# Altium schematic sheet EEG_3.SchDoc
size A3
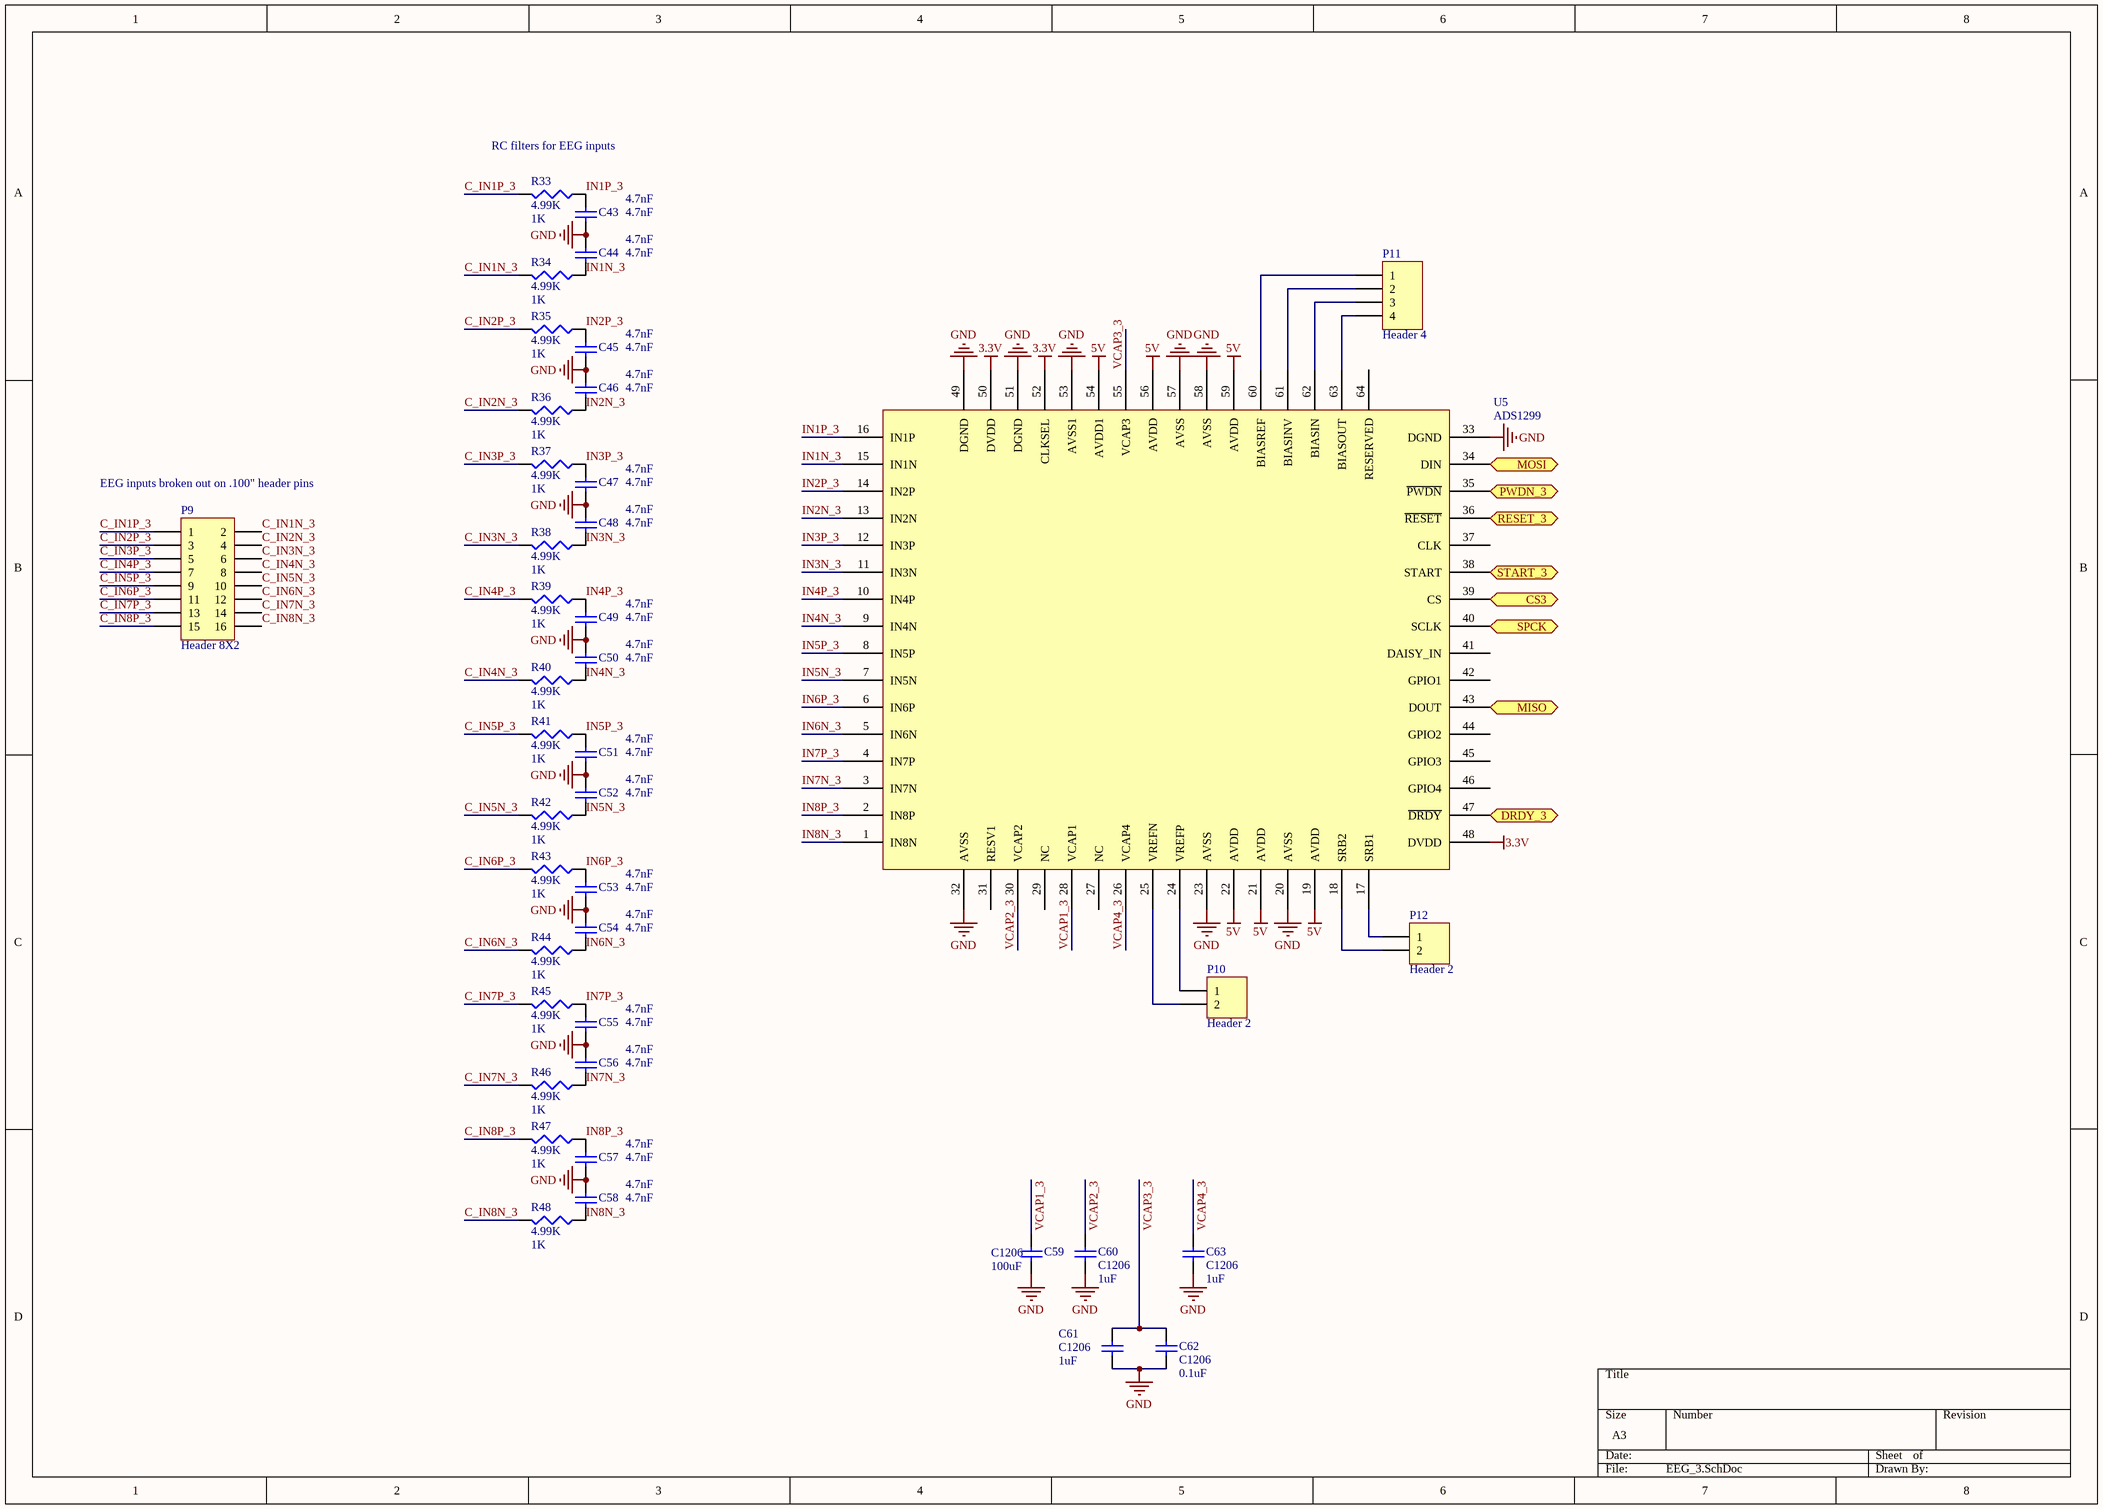
[diagram p0: EEG_3.SchDoc]

## Parts
C43  4.7nF  [1608[0603]]
C44  4.7nF  [1608[0603]]
C45  4.7nF  [1608[0603]]
C46  4.7nF  [1608[0603]]
C47  4.7nF  [1608[0603]]
C48  4.7nF  [1608[0603]]
C49  4.7nF  [1608[0603]]
C50  4.7nF  [1608[0603]]
C51  4.7nF  [1608[0603]]
C52  4.7nF  [1608[0603]]
C53  4.7nF  [1608[0603]]
C54  4.7nF  [1608[0603]]
C55  4.7nF  [1608[0603]]
C56  4.7nF  [1608[0603]]
C57  4.7nF  [1608[0603]]
C58  4.7nF  [1608[0603]]
C59  C1206  value 100uF  [1608[0603]]
C60  C1206  value 1uF  [1608[0603]]
C61  C1206  value 1uF  [1608[0603]]
C62  C1206  value 0.1uF  [1608[0603]]
C63  C1206  value 1uF  [1608[0603]]
P9  Header 8X2  [HDR2X8]
P10  Header 2  [HDR1X2]
P11  Header 4  [HDR1X4]
P12  Header 2  [HDR1X2]
R33  4.99K  value 1K  [1608[0603]]
R34  4.99K  value 1K  [1608[0603]]
R35  4.99K  value 1K  [1608[0603]]
R36  4.99K  value 1K  [1608[0603]]
R37  4.99K  value 1K  [1608[0603]]
R38  4.99K  value 1K  [1608[0603]]
R39  4.99K  value 1K  [1608[0603]]
R40  4.99K  value 1K  [1608[0603]]
R41  4.99K  value 1K  [1608[0603]]
R42  4.99K  value 1K  [1608[0603]]
R43  4.99K  value 1K  [1608[0603]]
R44  4.99K  value 1K  [1608[0603]]
R45  4.99K  value 1K  [1608[0603]]
R46  4.99K  value 1K  [1608[0603]]
R47  4.99K  value 1K  [1608[0603]]
R48  4.99K  value 1K  [1608[0603]]
U5  ADS1299  [ADS1299 Plastic QFP]

## Ports
CS3, DRDY_3, MISO, MOSI, PWDN_3, RESET_3, SPCK, START_3

## Nets
3.3V: U5.48(DVDD) U5.50(DVDD) U5.52(CLKSEL)
5V: U5.19(AVDD) U5.21(AVDD) U5.22(AVDD) U5.54(AVDD1) U5.56(AVDD) U5.59(AVDD)
GND: C43.1 C44.2 C45.1 C46.2 C47.1 C48.2 C49.1 C50.2 C51.1 C52.2 C53.1 C54.2 C55.1 C56.2 C57.1 C58.2 C59.2 C60.1 C61.2 C62.1 C63.1 U5.20(AVSS) U5.23(AVSS) U5.32(AVSS) U5.33(DGND) U5.49(DGND) U5.51(DGND) U5.53(AVSS1) U5.57(AVSS) U5.58(AVSS)
C_IN1N_3: P9.2 R34.2
C_IN1P_3: P9.1 R33.2
C_IN2N_3: P9.4 R36.2
C_IN2P_3: P9.3 R35.2
C_IN3N_3: P9.6 R38.2
C_IN3P_3: P9.5 R37.2
C_IN4N_3: P9.8 R40.2
C_IN4P_3: P9.7 R39.2
C_IN5N_3: P9.10 R42.2
C_IN5P_3: P9.9 R41.2
C_IN6N_3: P9.12 R44.2
C_IN6P_3: P9.11 R43.2
C_IN7N_3: P9.14 R46.2
C_IN7P_3: P9.13 R45.2
C_IN8N_3: P9.16 R48.2
C_IN8P_3: P9.15 R47.2
CS3: U5.39(CS) ; port CS3
DRDY_3: U5.47(~{DRDY}) ; port DRDY_3
IN1N_3: C44.1 R34.1 U5.15(IN1N)
IN1P_3: C43.2 R33.1 U5.16(IN1P)
IN2N_3: C46.1 R36.1 U5.13(IN2N)
IN2P_3: C45.2 R35.1 U5.14(IN2P)
IN3N_3: C48.1 R38.1 U5.11(IN3N)
IN3P_3: C47.2 R37.1 U5.12(IN3P)
IN4N_3: C50.1 R40.1 U5.9(IN4N)
IN4P_3: C49.2 R39.1 U5.10(IN4P)
IN5N_3: C52.1 R42.1 U5.7(IN5N)
IN5P_3: C51.2 R41.1 U5.8(IN5P)
IN6N_3: C54.1 R44.1 U5.5(IN6N)
IN6P_3: C53.2 R43.1 U5.6(IN6P)
IN7N_3: C56.1 R46.1 U5.3(IN7N)
IN7P_3: C55.2 R45.1 U5.4(IN7P)
IN8N_3: C58.1 R48.1 U5.1(IN8N)
IN8P_3: C57.2 R47.1 U5.2(IN8P)
MISO: U5.43(DOUT) ; port MISO
MOSI: U5.34(DIN) ; port MOSI
PWDN_3: U5.35(~{PWDN}) ; port PWDN_3
RESET_3: U5.36(~{RESET}) ; port RESET_3
SPCK: U5.40(SCLK) ; port SPCK
START_3: U5.38(START) ; port START_3
VCAP1_3: C59.1 U5.28(VCAP1)
VCAP2_3: C60.2 U5.30(VCAP2)
VCAP3_3: C61.1 C62.2 U5.55(VCAP3)
VCAP4_3: C63.2 U5.26(VCAP4)
NetP10_1: P10.1 U5.24(VREFP)
NetP10_2: P10.2 U5.25(VREFN)
NetP11_1: P11.1 U5.60(BIASREF)
NetP11_2: P11.2 U5.61(BIASINV)
NetP11_3: P11.3 U5.62(BIASIN)
NetP11_4: P11.4 U5.63(BIASOUT)
NetP12_1: P12.1 U5.17(SRB1)
NetP12_2: P12.2 U5.18(SRB2)

Not connected (* = marked no-connect by the designer): U5 27(NC) 29(NC) 31(RESV1) 37(CLK) 41(DAISY_IN) 42(GPIO1) 44(GPIO2) 45(GPIO3) 46(GPIO4) 64(RESERVED)

## Notes on the sheet
- RC filters for EEG inputs
- (near P9) EEG inputs broken out on .100" header pins

## Library data of the parts
C43-C63 = Cap Semi: Capacitor (Semiconductor SIM Model); Published: 8-Jun-2000; LatestRevisionDate: 29-May-2009; LatestRevisionNote: IPC-7351 Footprint Added.; PackageReference: C1206; Publisher: Altium Limited; PackageDescription: Chip Capacitor
  C43-C58: Value: 4.7nF
P9 = Header 8X2: Header, 8-Pin, Dual row; LatestRevisionDate: 17-Jul-2002; LatestRevisionNote: Re-released for DXP Platform.; Publisher: Altium Limited
P10 P12 = Header 2: Header, 2-Pin; LatestRevisionDate: 17-Jul-2002; LatestRevisionNote: Re-released for DXP Platform.; Publisher: Altium Limited
P11 = Header 4: Header, 4-Pin; LatestRevisionDate: 17-Jul-2002; LatestRevisionNote: Re-released for DXP Platform.; Publisher: Altium Limited
R33-R48 = Res3: Resistor; Published: 8-Jun-2000; LatestRevisionDate: 29-May-2009; LatestRevisionNote: IPC-7351 Footprint Added.; PackageReference: J1-0603; Publisher: Altium Limited; PackageDescription: Chip Resistor